# Altium project H18R1.PrjPcb (part 2 of 2)
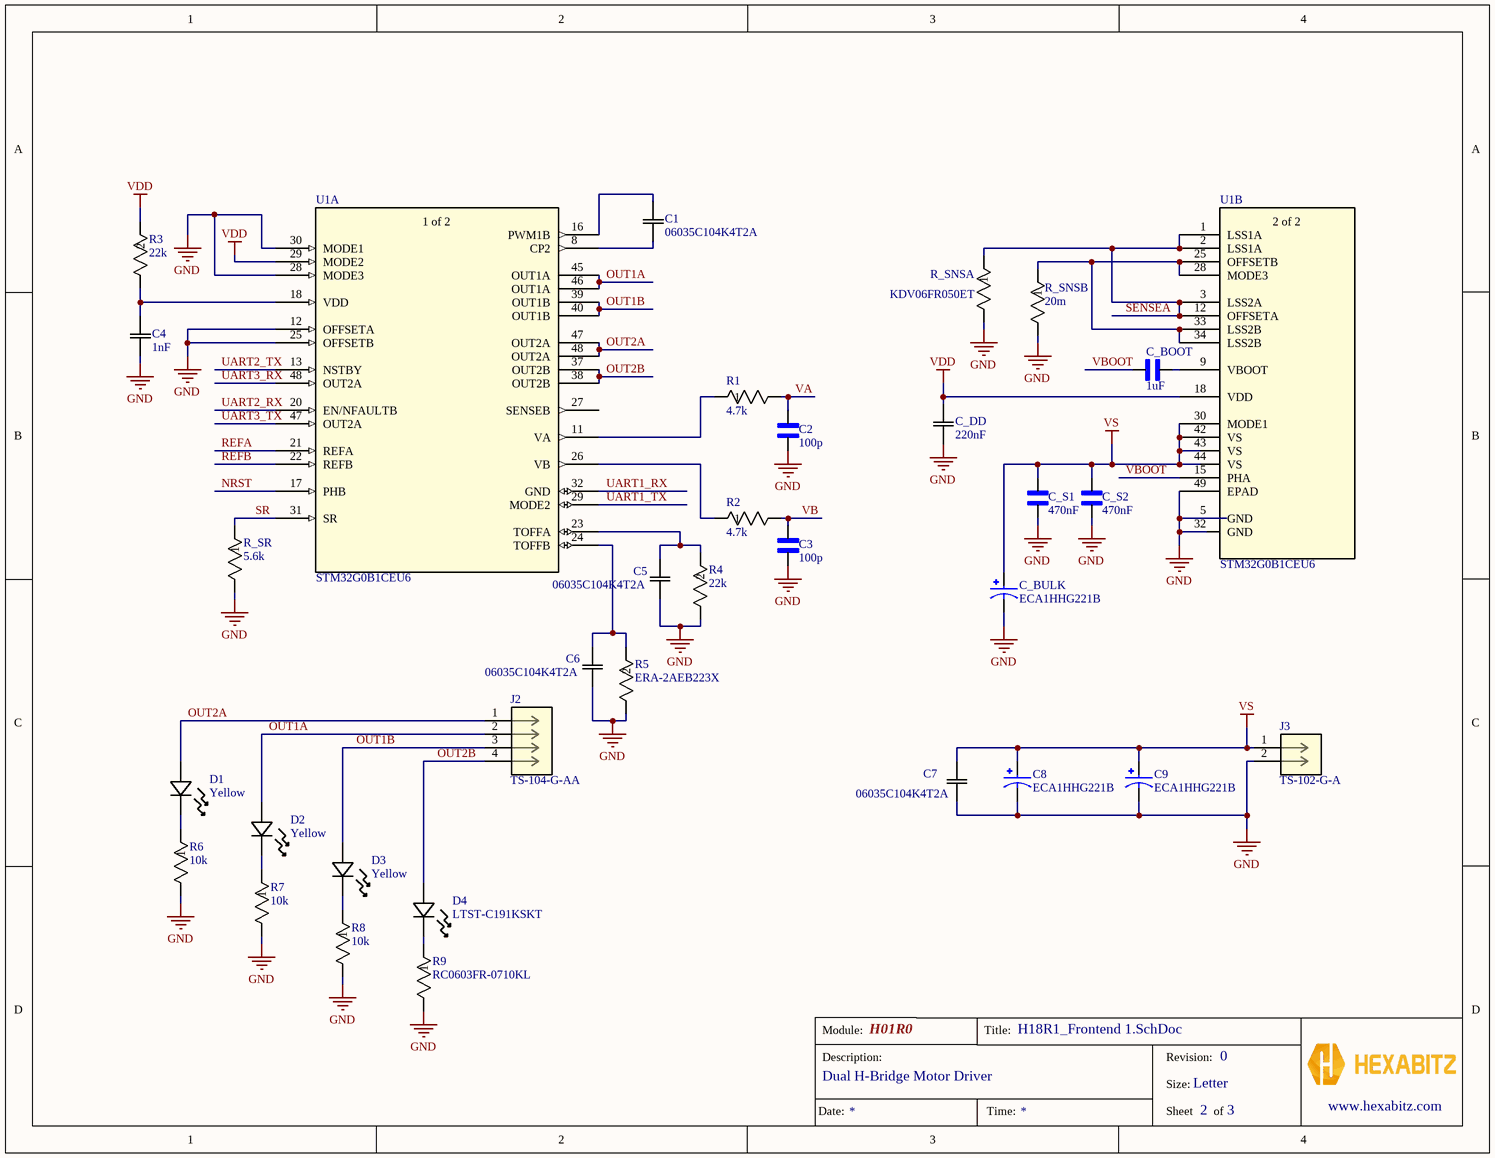
[diagram p2: H18R1_Frontend 1.SchDoc]

## Nets that join several sheets
GND: H18R1_Backend_backup (15 pins), H18R1_Frontend 1 (29 pins)
VDD: H18R1_Backend_backup (10 pins), H18R1_Frontend 1 (C_DD.1 R3.2 U1.18 U1.29)
NRST: H18R1_Backend_backup (C10.2 J?.3), H18R1_Frontend 1 (U1.17)
UART1_RX: H18R1_Backend_backup (U?.32), H18R1_Frontend 1 (U1.32)
UART1_TX: H18R1_Backend_backup (SU4.UART_U U?.29), H18R1_Frontend 1 (U1.29)
UART2_RX: H18R1_Backend_backup (SD2.UART_D U?.14), H18R1_Frontend 1 (U1.20)
UART2_TX: H18R1_Backend_backup (SU2.UART_U U?.13), H18R1_Frontend 1 (U1.13)
UART3_RX: H18R1_Backend_backup (SD3.UART_D U?.48), H18R1_Frontend 1 (U1.48)
UART3_TX: H18R1_Backend_backup (SU3.UART_U U?.47), H18R1_Frontend 1 (U1.47)